# EAGLE board Schematic V1 (EAGLE 9.6.2), part 1 of 2
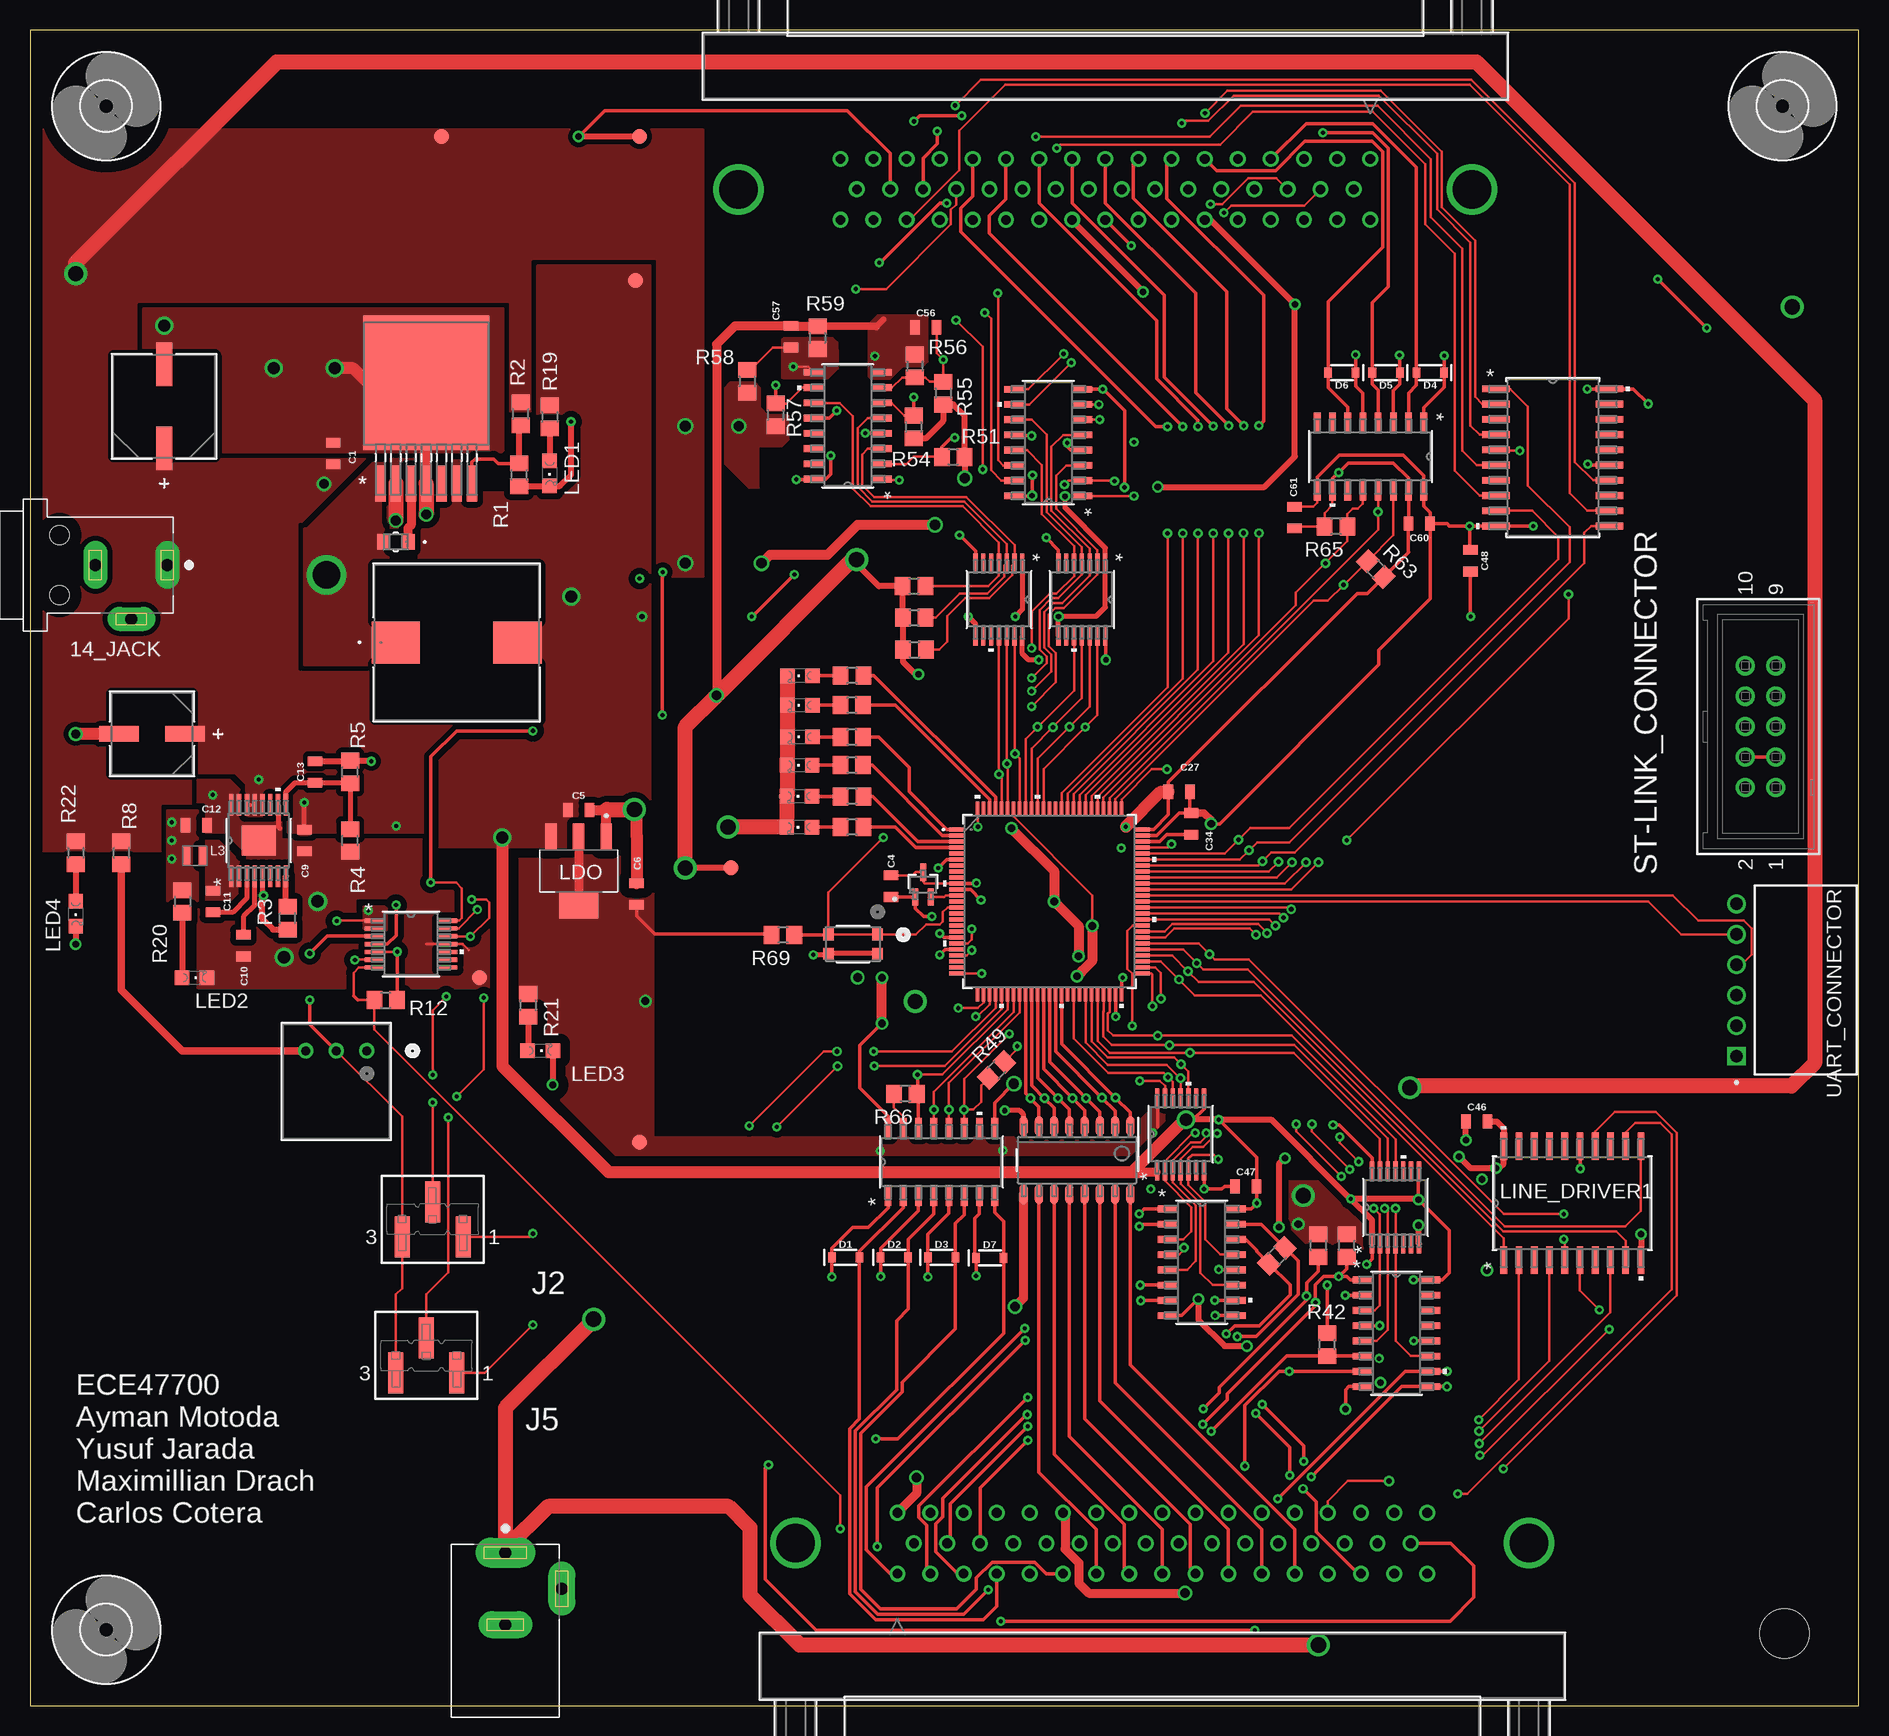
[diagram p4: board, top side]
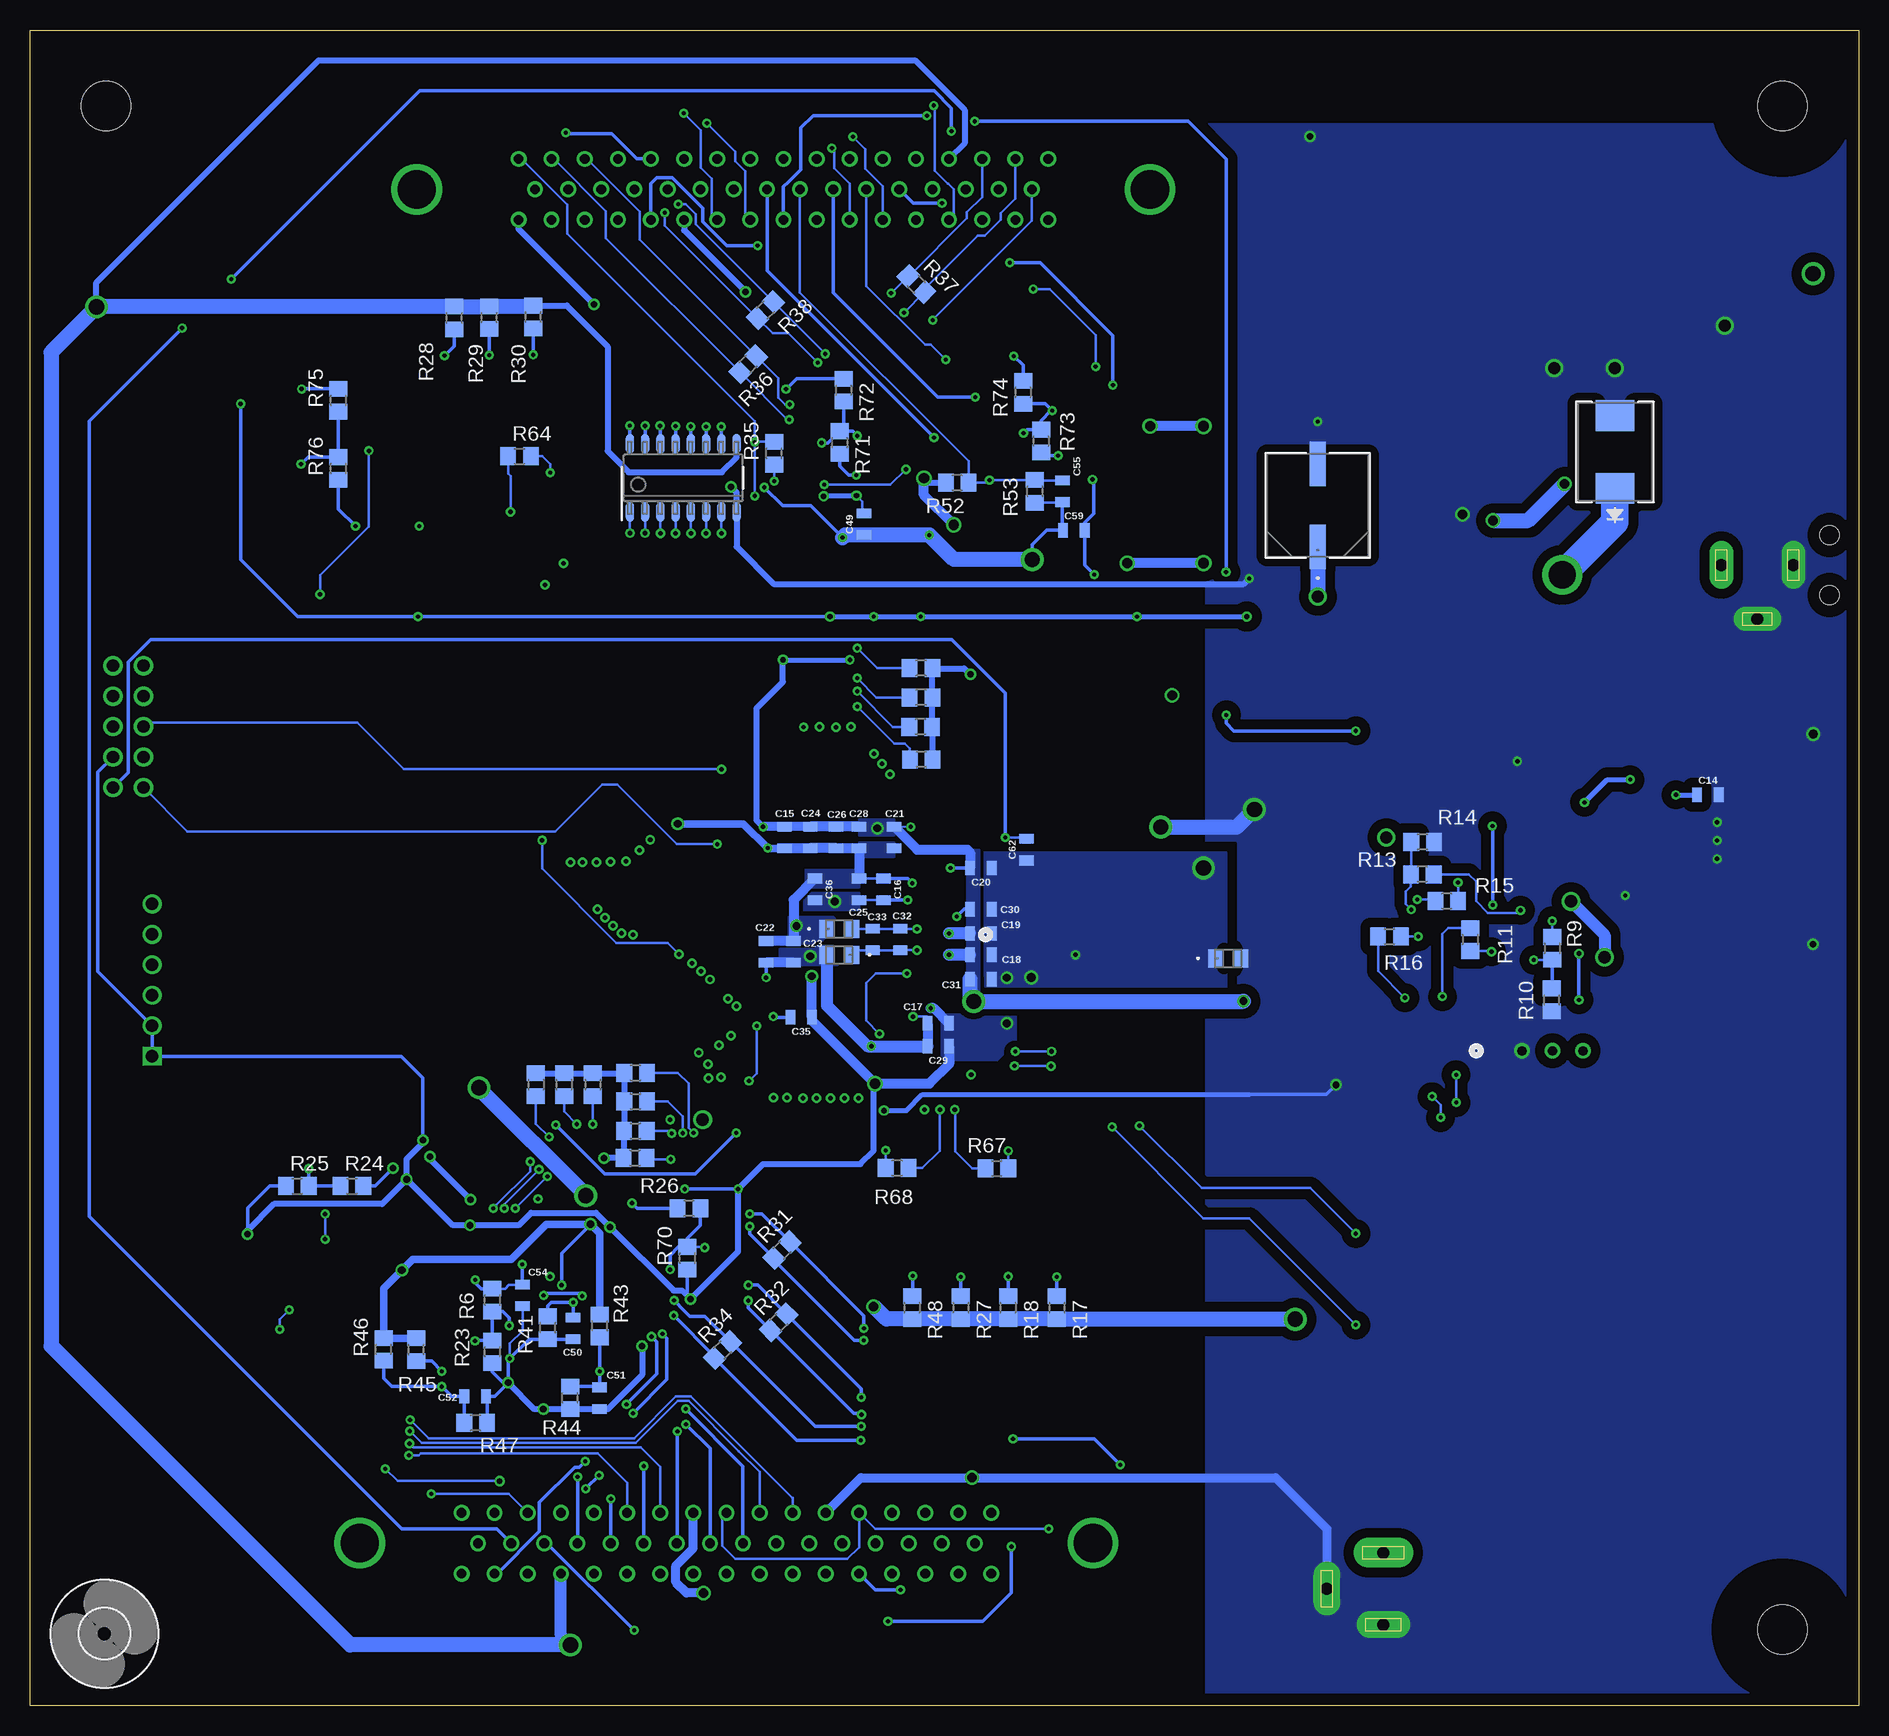
[diagram p5: board, bottom side, seen from below]

Size 152.4 x 139.7 mm. Coordinates in mm from the lower left corner, seen from the top.
Outline: 0,0 152.4,0 152.4,139.7 0,139.7 0,0
Copper layers (1*16): Top 0.035mm / dielectric 1.5mm / Bottom 0.035mm
Design rules "477": minimum track width 6mil, minimum drill 0.35mm, track to track 6mil, track to pad 6mil, pad to pad 6mil, via to via 6mil, smd to smd 6mil, copper to edge 40mil, drill to drill 6mil, minimum pad ring 10mil, minimum via ring 8mil, stop-mask expansion 4mil, vias tented up to drill 0mil, thermal gap 10mil

## Footprints (pad centres in the part's own frame; a part is rotated, then mirrored left to right if it is on the bottom)
G-21_MUR-M = smd 1.067 x 1.295: 1 -1.029,0; 2 1.029,0
TS7B-M = smd 0.864 x 2.997: 1 -3.81,-8.331; 2 -2.54,-8.331; 3 -1.27,-8.331; 4 0,-8.331; 5 1.27,-8.331; 6 2.54,-8.331; 7 3.81,-8.331 | smd 10.516 x 11.176: 8 0,0.051
IND_BOURNS_SRP1270-M = smd 4.039 x 3.505: 1 -5.08,0; 2 5.08,0
CUI_PJ-025 = drill 1 pad 2 long: 1 0,0; 2 6,0; 3 3,4.5 | hole 1.6: 9,2.5; 9,-2.5
PCAP_SVP_E7_PAN-M = smd 3.607 x 1.321: 1 -3.505,0; 2 3.505,0
CAP_SVPC_E7_PAN-M = smd 3.708 x 1.321: 1 -3.454,0; 2 3.454,0
PWP16_TEX-M = smd 1.778 x 0.356: 1 -2.972,2.275; 2 -2.972,1.625; 3 -2.972,0.975; 4 -2.972,0.325; 5 -2.972,-0.325; 6 -2.972,-0.975; 7 -2.972,-1.625; 8 -2.972,-2.275; 9 2.972,-2.275; 10 2.972,-1.625; 11 2.972,-0.975; 12 2.972,-0.325; 13 2.972,0.325; 14 2.972,0.975; 15 2.972,1.625; 16 2.972,2.275 | smd 2.464 x 2.819: EPAD 0,0
TL6330_EWI = smd 0.889 x 0.991: 1 -2.05,-0.8; 2 2.05,-0.8; 3 -2.05,0.8; 4 2.05,0.8
0805 = smd 0.8 x 1.2: 1 -0.9,0; 2 0.9,0
PCAP_6.3X7.7-ELECT_NCA-M = smd 3.302 x 1.295: 1 -2.756,0; 2 2.756,0
SOD-323 = smd 0.63 x 0.83: A 1.15,0; C -1.15,0
CDBC-G-M = smd 2.565 x 3.2: 1 -3.035,0; 2 3.035,0
4,1 = hole 4.1: 0,0
CUI_PJ-202AH = drill 1 pad 2.5 long: 1 -6.5,0 | drill 1 pad 2.25 long: 2 -0.5,0; 3 -3.5,4.7
TSM-103-01-L-SV = smd 1.27 x 3.43: 1 -2.54,1.46; 2 0,-1.46; 3 2.54,1.46
CONN_DD50P564GTXLF_AMP = drill 0.813 pad 1.321: 1 22.073,-15.469; 2 19.329,-15.469; 3 16.561,-15.469; 4 13.792,-15.469; 5 11.049,-15.469; 6 8.28,-15.469; 7 5.512,-15.469; 8 2.769,-15.469; 9 0,-15.469; 10 -2.769,-15.469; 11 -5.512,-15.469; 12 -8.28,-15.469; 13 -11.049,-15.469; 14 -13.792,-15.469; 15 -16.561,-15.469; 16 -19.329,-15.469; 17 -22.073,-15.469; 18 20.701,-12.929; 19 17.932,-12.929; 20 15.189,-12.929; 21 12.421,-12.929; 22 9.652,-12.929; 23 6.909,-12.929; 24 4.14,-12.929; 25 1.372,-12.929; 26 -1.372,-12.929; 27 -4.14,-12.929; 28 -6.909,-12.929; 29 -9.652,-12.929; 30 -12.421,-12.929; 31 -15.189,-12.929; 32 -17.932,-12.929; 33 -20.701,-12.929; 34 22.073,-10.389; 35 19.329,-10.389; 36 16.561,-10.389; 37 13.792,-10.389; 38 11.049,-10.389; 39 8.28,-10.389; 40 5.512,-10.389; 41 2.769,-10.389; 42 0,-10.389; 43 -2.769,-10.389; 44 -5.512,-10.389; 45 -8.28,-10.389; 46 -11.049,-10.389; 47 -13.792,-10.389; 48 -16.561,-10.389; 49 -19.329,-10.389; 50 -22.073,-10.389 | drill 3.2 pad 3.2: 51 -30.556,-12.929; 52 30.556,-12.929
IND_BLM21_MUR-M = smd 1.27 x 1.499: 1 -1.029,0; 2 1.029,0
IND_VLS201610CX-220M-1 = smd 0.65 x 1.6: 1 -0.675,0; 2 0.675,0
VREG_TLV1117LV33DCYR = smd 2.15 x 0.95: 1 -2.9,2.3; 2 -2.9,0; 3 -2.9,-2.3 | smd 2.15 x 3.25: 4 2.9,0
CHIPLED_0805 = smd 1.2 x 1.2: A 0,-1.05; C 0,1.05
TSSOP-14_JRT-M = smd 1.587 x 0.356: 1 -3.042,1.95; 2 -3.042,1.3; 3 -3.042,0.65; 4 -3.042,0; 5 -3.042,-0.65; 6 -3.042,-1.3; 7 -3.042,-1.95; 8 3.042,-1.95; 9 3.042,-1.3; 10 3.042,-0.65; 11 3.042,0; 12 3.042,0.65; 13 3.042,1.3; 14 3.042,1.95
DW20-M = smd 2.286 x 0.559: 1 -4.737,5.715; 2 -4.737,4.445; 3 -4.737,3.175; 4 -4.737,1.905; 5 -4.737,0.635; 6 -4.737,-0.635; 7 -4.737,-1.905; 8 -4.737,-3.175; 9 -4.737,-4.445; 10 -4.737,-5.715; 11 4.737,-5.715; 12 4.737,-4.445; 13 4.737,-3.175; 14 4.737,-1.905; 15 4.737,-0.635; 16 4.737,0.635; 17 4.737,1.905; 18 4.737,3.175; 19 4.737,4.445; 20 4.737,5.715
D16-M = smd 1.664 x 0.559: 1 -2.826,4.445; 2 -2.826,3.175; 3 -2.826,1.905; 4 -2.826,0.635; 5 -2.826,-0.635; 6 -2.826,-1.905; 7 -2.826,-3.175; 8 -2.826,-4.445; 9 2.826,-4.445; 10 2.826,-3.175; 11 2.826,-1.905; 12 2.826,-0.635; 13 2.826,0.635; 14 2.826,1.905; 15 2.826,3.175; 16 2.826,4.445
D0016A_M = smd 1.65 x 0.65: 1 -2.825,4.445; 2 -2.825,3.175; 3 -2.825,1.905; 4 -2.825,0.635; 5 -2.825,-0.635; 6 -2.825,-1.905; 7 -2.825,-3.175; 8 -2.825,-4.445; 9 2.825,-4.445; 10 2.825,-3.175; 11 2.825,-1.905; 12 2.825,-0.635; 13 2.825,0.635; 14 2.825,1.905; 15 2.825,3.175; 16 2.825,4.445
TSSOP14_PW_R-PDSO-G14_TEX-M = smd 1.613 x 0.356: 1 -3.054,1.95; 2 -3.054,1.3; 3 -3.054,0.65; 4 -3.054,0; 5 -3.054,-0.65; 6 -3.054,-1.3; 7 -3.054,-1.95; 8 3.054,-1.95; 9 3.054,-1.3; 10 3.054,-0.65; 11 3.054,0; 12 3.054,0.65; 13 3.054,1.3; 14 3.054,1.95
SOIC_6400-00TE-M = smd 1.664 x 0.559: 1 -2.826,4.445; 2 -2.826,3.175; 3 -2.826,1.905; 4 -2.826,0.635; 5 -2.826,-0.635; 6 -2.826,-1.905; 7 -2.826,-3.175; 8 -2.826,-4.445; 9 2.826,-4.445; 10 2.826,-3.175; 11 2.826,-1.905; 12 2.826,-0.635; 13 2.826,0.635; 14 2.826,1.905; 15 2.826,3.175; 16 2.826,4.445
21-0075D_MXM-M = smd 0.508 x 1.422: 1 -0.65,-1.041; 2 0.65,-1.041; 3 0,1.041
R0805 = smd 1.3 x 1.5: 1 -0.95,0; 2 0.95,0
3352T_BRN = drill 0.762 pad 1.27: 1 0,0; 2 2.54,0; 3 5.08,0
SAMTEC-TST-105-01-X-D = drill 1.02 pad 1.62: 1 -5.08,-1.46; 2 -5.08,1.08; 3 -2.54,-1.46; 4 -2.54,1.08; 5 0,-1.46; 6 0,1.08; 7 2.54,-1.46; 8 2.54,1.08; 9 5.08,-1.46; 10 5.08,1.08
LQFP100-14X14MM = smd 1.194 x 0.305: 1 -7.75,6; 2 -7.75,5.5; 3 -7.75,5; 4 -7.75,4.5; 5 -7.75,4; 6 -7.75,3.5; 7 -7.75,3; 8 -7.75,2.5; 9 -7.75,2; 10 -7.75,1.5; 11 -7.75,1; 12 -7.75,0.5; 13 -7.75,0; 14 -7.75,-0.5; 15 -7.75,-1; 16 -7.75,-1.5; 17 -7.75,-2; 18 -7.75,-2.5; 19 -7.75,-3; 20 -7.75,-3.5; 21 -7.75,-4; 22 -7.75,-4.5; 23 -7.75,-5; 24 -7.75,-5.5; 25 -7.75,-6; 51 7.75,-6; 52 7.75,-5.5; 53 7.75,-5; 54 7.75,-4.5; 55 7.75,-4; 56 7.75,-3.5; 57 7.75,-3; 58 7.75,-2.5; 59 7.75,-2; 60 7.75,-1.5; 61 7.75,-1; 62 7.75,-0.5; 63 7.75,0; 64 7.75,0.5; 65 7.75,1; 66 7.75,1.5; 67 7.75,2; 68 7.75,2.5; 69 7.75,3; 70 7.75,3.5; 71 7.75,4; 72 7.75,4.5; 73 7.75,5; 74 7.75,5.5; 75 7.75,6 | smd 0.305 x 1.194: 26 -6,-7.75; 27 -5.5,-7.75; 28 -5,-7.75; 29 -4.5,-7.75; 30 -4,-7.75; 31 -3.5,-7.75; 32 -3,-7.75; 33 -2.5,-7.75; 34 -2,-7.75; 35 -1.5,-7.75; 36 -1,-7.75; 37 -0.5,-7.75; 38 0,-7.75; 39 0.5,-7.75; 40 1,-7.75; 41 1.5,-7.75; 42 2,-7.75; 43 2.5,-7.75; 44 3,-7.75; 45 3.5,-7.75; 46 4,-7.75; 47 4.5,-7.75; 48 5,-7.75; 49 5.5,-7.75; 50 6,-7.75; 76 6,7.75; 77 5.5,7.75; 78 5,7.75; 79 4.5,7.75; 80 4,7.75; 81 3.5,7.75; 82 3,7.75; 83 2.5,7.75; 84 2,7.75; 85 1.5,7.75; 86 1,7.75; 87 0.5,7.75; 88 0,7.75; 89 -0.5,7.75; 90 -1,7.75; 91 -1.5,7.75; 92 -2,7.75; 93 -2.5,7.75; 94 -3,7.75; 95 -3.5,7.75; 96 -4,7.75; 97 -4.5,7.75; 98 -5,7.75; 99 -5.5,7.75; 100 -6,7.75
PAD.03X.05 = smd 1.27 x 1.27: 1 0,0
SAMTEC_SSW-106-02-TM-S-RA = drill 1.04 pad 1.39 square: 01 0,0 | drill 1.04 pad 1.39: 02 -2.54,0; 03 -5.08,0; 04 -7.62,0; 05 -10.16,0; 06 -12.7,0

## Placement (x,y rotation side)
0.01UF_C7  GRM2195C1H103JA01DG-21_MUR-M  [G-21_MUR-M]  30.48,97.03 180 top
5V  LM2678S-5.0/NOPBTS7B-M  [TS7B-M]  33.02,110.24 0 top
10UH_L1  SRP1270-100MIND_BOURNS_SRP1270-M  [IND_BOURNS_SRP1270-M]  35.56,88.65 0 top
14_JACK  PJ-025  [CUI_PJ-025]  11.46,95.1 180 top
180UF  20SVPF180MPCAP_SVP_E7_PAN-M  [PCAP_SVP_E7_PAN-M]  11.18,108.33 90 top
330UF_C3  10SVPC330MCAP_SVPC_E7_PAN-M  [CAP_SVPC_E7_PAN-M]  45.09,100.08 90 bottom
-15V  LM43601PWPRPWP16_TEX-M  [PWP16_TEX-M]  19.05,72.14 90 top
BUTTON  TL6330AF200Q  [TL6330_EWI]  68.58,63.5 180 top
C1  0.1uF  [0805]  25.27,104.39 270 top
C4  10pF  [0805]  71.75,68.33 270 top
C5  1.0uF  [0805]  45.72,74.68 0 top
C6  1.0uF  [0805]  50.55,67.69 90 top
C8  68uF  [PCAP_6.3X7.7-ELECT_NCA-M]  10.16,81.03 180 top
C9  4.7uF  [0805]  22.86,72.14 90 top
C10  2.2uF  [0805]  17.78,63.37 90 top
C11  470nF  [0805]  15.24,67.06 270 top
C12  4.7uF  [0805]  13.84,73.41 180 top
C13  120pF  [0805]  23.75,77.85 90 top
C14  10uF  [0805]  12.57,75.95 0 bottom
C15  0.1uF  [0805]  89.53,72.39 90 bottom
C16  0.1uF  [0805]  81.28,68.07 270 bottom
C17  0.1uF  [0805]  76.71,56.9 180 bottom
C18  0.1uF  [0805]  73.15,62.61 180 bottom
C19  0.1uF  [0805]  73.15,64.39 180 bottom
C20  0.1uF  [0805]  73.15,69.85 180 bottom
C21  0.1uF  [0805]  80.39,72.39 90 bottom
C22  0.1uF  [0805]  91.06,62.87 270 bottom
C23  0.1uF  [0805]  88.77,62.87 270 bottom
C24  0.1uF  [0805]  87.38,72.39 90 bottom
C25  0.1uF  [0805]  83.31,68.07 270 bottom
C26  0.1uF  [0805]  85.22,72.39 90 bottom
C27  0.1uF  [0805]  95.76,76.2 180 top
C28  0.1uF  [0805]  83.31,72.39 90 bottom
C29  0.1uF  [0805]  76.71,54.99 180 bottom
C30  0.1uF  [0805]  73.15,66.42 180 bottom
C31  1.0uF  [0805]  73.15,60.58 180 bottom
C32  0.1uF  [0805]  79.88,63.88 270 bottom
C33  1.0uF  [0805]  82.17,63.88 270 bottom
C34  2.2uF  [0805]  96.77,73.53 270 top
C35  2.2uF  [0805]  88.14,57.4 180 bottom
C36  4.7uF  [0805]  87,68.07 270 bottom
C46  1.0uF  [0805]  120.57,48.72 0 top
C47  1.0uF  [0805]  101.32,43.31 0 top
C48  1.0uF  [0805]  120.04,95.45 270 top
C49  1.0uF  [0805]  82.91,98.5 90 bottom
C50  0.1uF  [0805]  107.14,31.47 90 bottom
C51  0.1uF  [0805]  104.93,25.65 90 bottom
C52  0.1uF  [0805]  115.32,25.81 180 bottom
C54  1.0uF  [0805]  111.35,34.21 90 bottom
C55  0.1uF  [0805]  66.37,101.24 90 bottom
C56  0.1uF  [0805]  74.65,114.91 0 top
C57  0.1uF  [0805]  63.42,114.12 270 top
C59  1.0uF  [0805]  65.41,97.99 0 bottom
C60  0.1uF  [0805]  115.77,98.55 180 top
C61  0.1uF  [0805]  105.38,99.06 270 top
C62  0.1uF  [0805]  69.34,71.37 90 bottom
D1  250mA/100V  [SOD-323]  67.97,37.39 0 top
D2  250mA/100V  [SOD-323]  72.03,37.39 0 top
D3  250mA/100V  [SOD-323]  75.97,37.39 0 top
D4  250mA/100V  [SOD-323]  116.69,111.15 180 top
D5  250mA/100V  [SOD-323]  113,111.15 180 top
D6  250mA/100V  [SOD-323]  109.32,111.15 180 top
D7  250mA/100V  [SOD-323]  79.98,37.36 0 top
DIODE  CDBC520-GCDBC-G-M  [CDBC-G-M]  20.32,104.52 90 bottom
H1  MOUNT-HOLE4.1  [4,1]  6.35,6.35 0 top
H2  MOUNT-HOLE4.1  [4,1]  146.2,6.02 0 bottom
H3  MOUNT-HOLE4.1  [4,1]  146.05,133.35 0 top
H4  MOUNT-HOLE4.1  [4,1]  6.35,133.35 0 top
J1  PJ-202AH  [CUI_PJ-202AH]  39.62,6.27 270 top
J2  TSM-103-01-L-SVJ  [TSM-103-01-L-SV]  33.55,40.56 180 top
J3  DD50P564GTXLF  [CONN_DD50P564GTXLF_AMP]  94.36,0.64 180 top
J4  DD50P564GTXLF  [CONN_DD50P564GTXLF_AMP]  89.61,139.34 0 top
J5  TSM-103-01-L-SVJ  [TSM-103-01-L-SV]  33.02,29.21 180 top
L2  BLM21PG600SN1DIND_BLM21_MUR-M  [IND_BLM21_MUR-M]  84.96,64.77 0 bottom
L3  22uH  [IND_VLS201610CX-220M-1]  13.72,70.87 0 top
L4  BLM21PG600SN1DIND_BLM21_MUR-M  [IND_BLM21_MUR-M]  52.55,62.31 0 bottom
L5  BLM21PG600SN1DIND_BLM21_MUR-M  [IND_BLM21_MUR-M]  84.96,62.61 180 bottom
LDO  TLV1117LV33DCYR  [VREG_TLV1117LV33DCYR]  45.72,69.6 270 top
LED1  BLUE  [CHIPLED_0805]  43.31,102.74 180 top
LED2  RED  [CHIPLED_0805]  13.72,60.71 270 top
LED3  GREEN  [CHIPLED_0805]  42.52,54.61 270 top
LED4  WHITE  [CHIPLED_0805]  3.81,66.04 180 top
LED5  UART_LED  [CHIPLED_0805]  64.16,85.88 90 top
LED6  POS_CON_LED  [CHIPLED_0805]  64.16,83.41 90 top
LED7  ALO1  [CHIPLED_0805]  64.16,80.77 90 top
LED8  ALO2  [CHIPLED_0805]  64.14,78.41 90 top
LED9  ALO3  [CHIPLED_0805]  64.11,75.82 90 top
LED10  INDIC_LED  [CHIPLED_0805]  64.11,73.25 90 top
LEVEL_SHIFTER1  RS0104YQTSSOP-14_JRT-M  [TSSOP-14_JRT-M]  113.79,41.55 90 top
LEVEL_SHIFTER2  RS0104YQTSSOP-14_JRT-M  [TSSOP-14_JRT-M]  95.89,47.65 90 top
LEVEL_SHIFTER3  RS0104YQTSSOP-14_JRT-M  [TSSOP-14_JRT-M]  87.66,92.23 270 top
LEVEL_SHIFTER4  RS0104YQTSSOP-14_JRT-M  [TSSOP-14_JRT-M]  80.75,92.23 270 top
LINE_DRIVER1  SN75ALS174ADWRDW20-M  [DW20-M]  128.52,41.91 90 top
LINE_DRIVER2  SN75ALS174ADWRDW20-M  [DW20-M]  126.9,104.06 0 top
LINE_RECEIVER1  SN65LBC175ADD16-M  [D16-M]  97.64,36.98 0 top
LINE_RECEIVER2  SN65LBC175ADD16-M  [D16-M]  113.87,31.06 0 top
LINE_RECEIVER3  SN65LBC175ADD16-M  [D16-M]  84.86,105.31 180 top
LINE_RECEIVER4  SN65LBC175ADD16-M  [D16-M]  68.15,106.71 180 top
NPN  SN75468DRD0016A_M  [D0016A_M]  87.25,45.49 270 top
NPN2  SN75468DRD0016A_M  [D0016A_M]  97.97,102.36 90 bottom
OP_AMP  OPA4205APWRTSSOP14_PW_R-PDSO-G14_TEX-M  [TSSOP14_PW_R-PDSO-G14_TEX-M]  31.75,63.5 0 top
OPTOCOUPLER  ACSL-6400-00TESOIC_6400-00TE-M  [SOIC_6400-00TE-M]  75.95,45.34 90 top
OPTOCOUPLER2  ACSL-6400-00TESOIC_6400-00TE-M  [SOIC_6400-00TE-M]  111.71,104.14 270 top
OSCILLATOR  MAX7375AXR805+T21-0075D_MXM-M  [21-0075D_MXM-M]  74.42,68.45 0 top
R1  25k  [R0805]  40.77,102.62 90 top
R2  75k  [R0805]  40.89,107.7 90 top
R3  105k  [R0805]  21.46,65.66 90 top
R4  73.2k  [R0805]  26.67,72.14 90 top
R5  1M  [R0805]  26.67,77.85 90 top
R6  33k  [R0805]  113.87,33.83 90 bottom
R7  3352T-1-105LF  [3352T_BRN]  28.07,54.61 180 top
R8  89k  [R0805]  7.62,71.12 90 top
R9  10k  [R0805]  25.55,63.14 270 bottom
R10  73k  [R0805]  25.58,58.85 90 bottom
R11  10k  [R0805]  32.38,63.88 270 bottom
R12  73k  [R0805]  29.64,58.83 0 top
R13  10k  [R0805]  36.37,69.32 180 bottom
R14  73k  [R0805]  36.35,72.01 180 bottom
R15  73k  [R0805]  34.34,67.08 180 bottom
R16  10k  [R0805]  39.12,64.14 0 bottom
R17  2.25k  [R0805]  66.83,33.2 270 bottom
R18  2.25k  [R0805]  70.89,33.2 270 bottom
R19  100  [R0805]  43.31,107.44 270 top
R20  680  [R0805]  12.7,67.06 270 top
R21  75  [R0805]  41.5,58.39 270 top
R22  560  [R0805]  3.81,71.12 270 top
R23  66k  [R0805]  113.87,29.51 90 bottom
R24  33k  [R0805]  125.58,43.33 0 bottom
R25  66k  [R0805]  130.12,43.33 0 bottom
R26  33k  [R0805]  97.49,41.48 180 bottom
R27  2.25k  [R0805]  74.83,33.2 270 bottom
R28  2.25k  [R0805]  117.04,115.7 90 bottom
R29  2.25k  [R0805]  114.12,115.72 90 bottom
R30  2.25k  [R0805]  110.46,115.77 90 bottom
R31  330  [R0805]  89.74,38 45 bottom
R32  330  [R0805]  90.02,31.98 45 bottom
R33  330  [R0805]  103.91,37.52 45 top
R34  330  [R0805]  94.69,29.67 45 bottom
R35  330  [R0805]  90.4,104.42 90 bottom
R36  330  [R0805]  92.56,111.84 225 bottom
R37  330  [R0805]  78.54,118.52 315 bottom
R38  330  [R0805]  91.11,116.36 225 bottom
R39  500  [R0805]  107.37,38.38 90 top
R40  75k  [R0805]  109.73,38.38 90 top
R41  25k  [R0805]  109.25,31.52 90 bottom
R42  500  [R0805]  108.1,30.12 90 top
R43  75k  [R0805]  104.93,31.67 90 bottom
R44  25k  [R0805]  107.39,25.68 90 bottom
R45  500  [R0805]  120.22,29.69 90 bottom
R46  75k  [R0805]  122.94,29.72 90 bottom
R47  25k  [R0805]  115.27,23.6 180 bottom
R48  2.25k  [R0805]  78.89,33.2 270 bottom
R49  1k  [R0805]  80.54,53.01 45 top
R50  150  [R0805]  68.5,85.88 180 top
R51  500  [R0805]  76.94,104.11 0 top
R52  75k  [R0805]  75.13,101.96 180 bottom
R53  25k  [R0805]  68.66,101.24 90 bottom
R54  500  [R0805]  73.63,106.6 270 top
R55  75k  [R0805]  76.1,109.42 270 top
R56  25k  [R0805]  73.74,111.68 270 top
R57  500  [R0805]  62.13,107.62 270 top
R58  75k  [R0805]  59.77,110.41 270 top
R59  25k  [R0805]  65.63,114.05 270 top
R60  150  [R0805]  68.48,83.41 180 top
R61  150  [R0805]  68.48,80.75 180 top
R62  150  [R0805]  68.48,78.41 180 top
R63  1k  [R0805]  112.14,94.77 315 top
R64  1k  [R0805]  111.61,104.17 0 bottom
R65  1k  [R0805]  108.84,98.32 180 top
R66  1k  [R0805]  72.95,51.03 180 top
R67  1k  [R0805]  71.83,44.81 0 bottom
R68  1k  [R0805]  80.14,44.83 180 bottom
R69  10k  [R0805]  62.74,64.26 180 top
R70  66k  [R0805]  97.61,37.31 90 bottom
R71  33k  [R0805]  84.94,105.31 270 bottom
R72  66k  [R0805]  84.61,109.68 270 bottom
R73  33k  [R0805]  68.15,105.44 270 bottom
R74  66k  [R0805]  69.65,109.5 270 bottom
R75  33k  [R0805]  126.7,108.84 90 bottom
R76  66k  [R0805]  126.7,103.15 90 bottom
R77  150  [R0805]  68.5,75.82 180 top
R78  150  [R0805]  68.5,73.25 180 top
R79  10k  [R0805]  110.24,51.79 270 bottom
R80  10k  [R0805]  107.9,51.79 270 bottom
R81  10k  [R0805]  105.51,51.79 270 bottom
R82  10k  [R0805]  73.66,93.34 0 top
R83  10k  [R0805]  73.69,90.73 0 top
R84  10k  [R0805]  73.71,88.04 0 top
R85  10k  [R0805]  78.16,84.07 180 bottom
R86  10k  [R0805]  78.18,81.61 180 bottom
R87  10k  [R0805]  78.13,78.89 180 bottom
R88  10k  [R0805]  78.16,86.51 180 bottom
R89  10k  [R0805]  101.96,47.93 0 bottom
R90  10k  [R0805]  101.93,50.39 0 bottom
R91  10k  [R0805]  101.93,52.78 0 bottom
R92  10k  [R0805]  101.98,45.67 0 bottom
ST-LINK_CONNECTOR  SAMTEC-TST-105-01-X-DJ  [SAMTEC-TST-105-01-X-D]  144.02,81.64 90 top
STM32F2  STM32F207VGT6TR  [LQFP100-14X14MM]  84.96,67.06 0 top
TP1  TEST-POINT3X5  [PAD.03X.05]  50.44,118.82 0 top
TP2  TEST-POINT3X5  [PAD.03X.05]  37.47,60.68 0 top
TP3  TEST-POINT3X5  [PAD.03X.05]  50.8,46.99 0 top
TP4  TEST-POINT3X5  [PAD.03X.05]  34.29,130.81 0 top
TP5  TEST-POINT3X5  [PAD.03X.05]  50.8,130.81 0 top
TP6  TEST-POINT3X5  [PAD.03X.05]  58.42,69.85 0 top
UART_CONNECTOR  SSW-106-02-TM-S-RA  [SAMTEC_SSW-106-02-TM-S-RA]  142.21,54.15 270 top